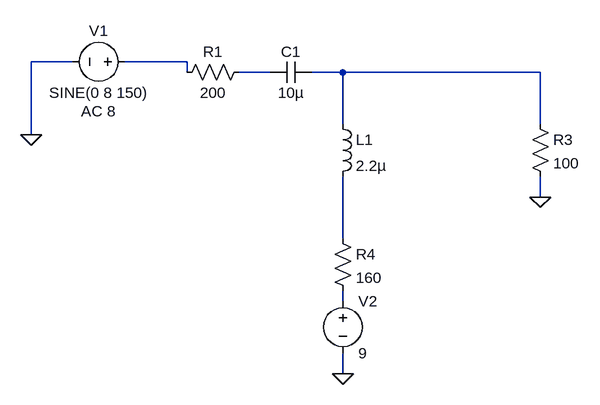
[diagram p0: schematic bias-t.asc]
bias-t.asc, the LTspice schematic file:
Version 4
SHEET 1 880 680
WIRE -240 48 -304 48
WIRE -64 48 -160 48
WIRE -64 64 -64 48
WIRE 64 64 16 64
WIRE 176 64 128 64
WIRE 480 64 176 64
WIRE 176 144 176 64
WIRE 480 144 480 64
WIRE -304 160 -304 48
WIRE 480 256 480 224
WIRE 176 320 176 224
WIRE 176 416 176 400
WIRE 176 528 176 496
FLAG -304 160 0
FLAG 480 256 0
FLAG 176 528 0
SYMBOL voltage -144 48 R90
WINDOW 0 -32 56 VBottom 2
WINDOW 3 32 56 VTop 2
WINDOW 123 60 56 VTop 2
WINDOW 39 0 0 Left 2
SYMATTR InstName V1
SYMATTR Value SINE(0 8 150)
SYMATTR Value2 AC 8
SYMBOL res -80 80 R270
WINDOW 0 32 56 VTop 2
WINDOW 3 0 56 VBottom 2
SYMATTR InstName R1
SYMATTR Value 200
SYMBOL cap 64 80 R270
WINDOW 0 32 32 VTop 2
WINDOW 3 0 32 VBottom 2
SYMATTR InstName C1
SYMATTR Value 10µ
SYMBOL ind 160 128 R0
SYMATTR InstName L1
SYMATTR Value 2.2µ
SYMBOL res 464 128 R0
SYMATTR InstName R3
SYMATTR Value 100
SYMBOL voltage 176 400 R0
WINDOW 123 0 0 Left 2
WINDOW 39 0 0 Left 2
SYMATTR InstName V2
SYMATTR Value 9
SYMBOL res 160 304 R0
SYMATTR InstName R4
SYMATTR Value 160

The netlist it stands for:
* bias-t.asc
V1 N001 0 SINE(0 8 150) AC 8
R1 N001 N002 200
C1 N002 N003 10µ
L1 N003 N004 2.2µ
R3 N003 0 100
V2 N005 0 9
R4 N004 N005 160
.backanno
.end